# Altium project tree.PrjPcb
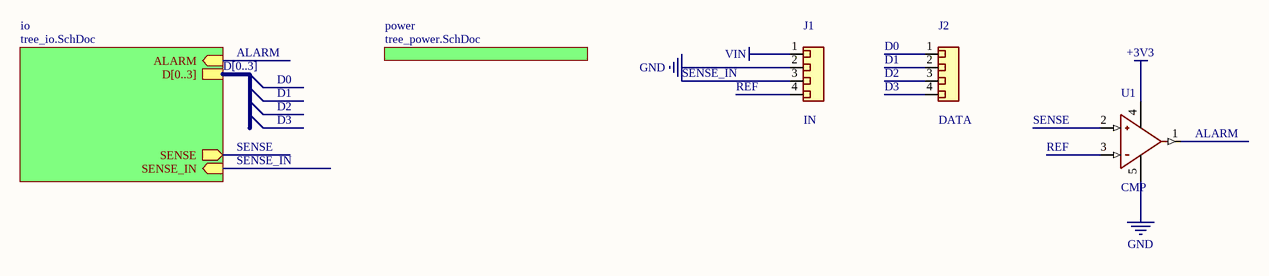
[diagram p0: tree.SchDoc]
4 sheets, 12 parts. Net scope: hierarchical (ports join the sheet entries above them; power ports are global).
Sheets:
  tree.SchDoc
    io = tree_io.SchDoc
      leds = tree_io.leds.SchDoc
    power = tree_power.SchDoc

## Sheet tree.SchDoc
size A4

### Parts
J1  IN  [HDR1X4]
J2  DATA  [HDR1X4]
U1  CMP  [SOT23-5]

### Sub-sheets
io = tree_io.SchDoc: ALARM (in), D[0..3], SENSE (out), SENSE_IN (in)
power = tree_power.SchDoc: no entries

### Nets
+3V3: U1.4(V+)
GND: J1.2(Passive) U1.5(V-)
VIN: J1.1(Passive)
ALARM: U1.1 ; sheet io/ALARM
D0: J2.1(Passive)
D1: J2.2(Passive)
D2: J2.3(Passive)
D3: J2.4(Passive)
REF: J1.4(Passive) U1.3(-)
SENSE: U1.2(+) ; sheet io/SENSE
SENSE_IN: J1.3(Passive) ; sheet io/SENSE_IN

### Buses and harness runs
bus D[0..3] = sheet io/D[0..3]

### Library data of the parts
J1 J2 = Connector_4
U1 = Comparator

## Sheet tree_io.SchDoc
size A4
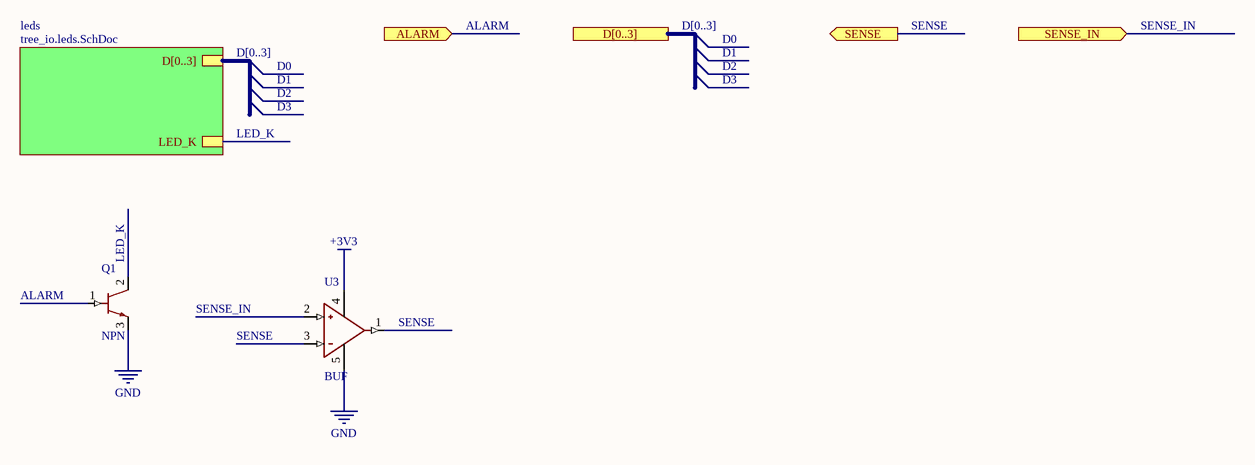
[diagram p1: tree_io.SchDoc]

### Parts
Q1  NPN  [SOT23]
U3  BUF  [SOT23-5]

### Sub-sheets
leds = tree_io.leds.SchDoc: D[0..3], LED_K

### Ports
ALARM (in), D[0..3], SENSE (out), SENSE_IN (in)

### Nets
+3V3: U3.4(V+)
GND: Q1.3(E) U3.5(V-)
ALARM: Q1.1(B) ; port ALARM
LED_K: Q1.2(C) ; sheet leds/LED_K
SENSE: U3.1 U3.3(-) ; port SENSE
SENSE_IN: U3.2(+) ; port SENSE_IN

### Buses and harness runs
bus D[0..3] = port D[0..3]
bus D[0..3] = sheet leds/D[0..3]

### Library data of the parts
Q1 = BJT_NPN
U3 = Operational_Amplifier

## Sheet tree_io.leds.SchDoc
size A4
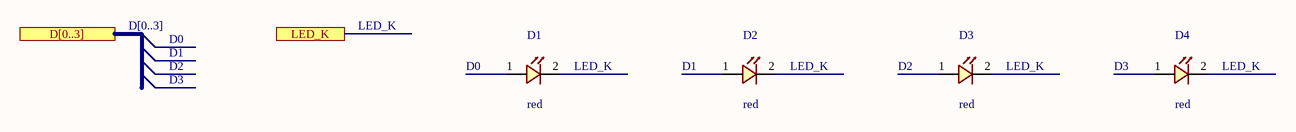
[diagram p2: tree_io.leds.SchDoc]

### Parts
D1  red  [LED0603]
D2  red  [LED0603]
D3  red  [LED0603]
D4  red  [LED0603]

### Ports
D[0..3], LED_K

### Nets
D0: D1.1(A)
D1: D2.1(A)
D2: D3.1(A)
D3: D4.1(A)
LED_K: D1.2(K) D2.2(K) D3.2(K) D4.2(K) ; port LED_K

### Buses and harness runs
bus D[0..3] = port D[0..3]

### Library data of the parts
D1-D4 = LED

## Sheet tree_power.SchDoc
size A4
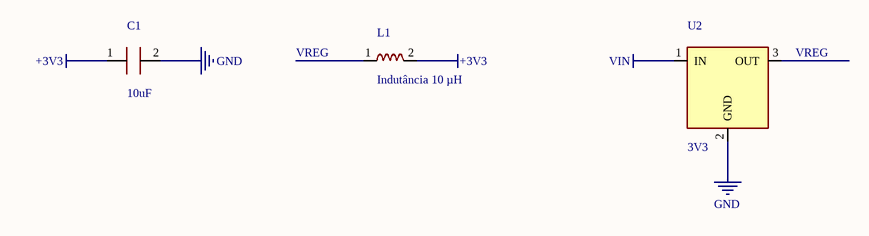
[diagram p3: tree_power.SchDoc]

### Parts
C1  10uF  [C0603]
L1  Indutância 10 µH  [L0805]
U2  3V3  [SOT223]

### Nets
+3V3: C1.1(A) L1.2(B)
GND: C1.2(B) U2.2(GND)
VIN: U2.1(IN)
VREG: L1.1(A) U2.3(OUT)

### Library data of the parts
C1 = Capacitor: MPN: X-1; Note: tolerância ±10 %
L1 = Inductor
U2 = Linear_Regulator

## Nets that join several sheets
+3V3: tree (U1.4), tree_io (U3.4), tree_power (C1.1 L1.2)
GND: tree (J1.2 U1.5), tree_io (Q1.3 U3.5), tree_power (C1.2 U2.2)
VIN: tree (J1.1), tree_power (U2.1)
ALARM: tree (U1.1), tree_io (Q1.1)
D0: tree (J2.1), tree_io.leds (D1.1)
D1: tree (J2.2), tree_io.leds (D2.1)
D2: tree (J2.3), tree_io.leds (D3.1)
D3: tree (J2.4), tree_io.leds (D4.1)
LED_K: tree_io (Q1.2), tree_io.leds (D1.2 D2.2 D3.2 D4.2)
SENSE: tree (U1.2), tree_io (U3.1 U3.3)
SENSE_IN: tree (J1.3), tree_io (U3.2)